# Altium project Boost_shield.PrjPcb
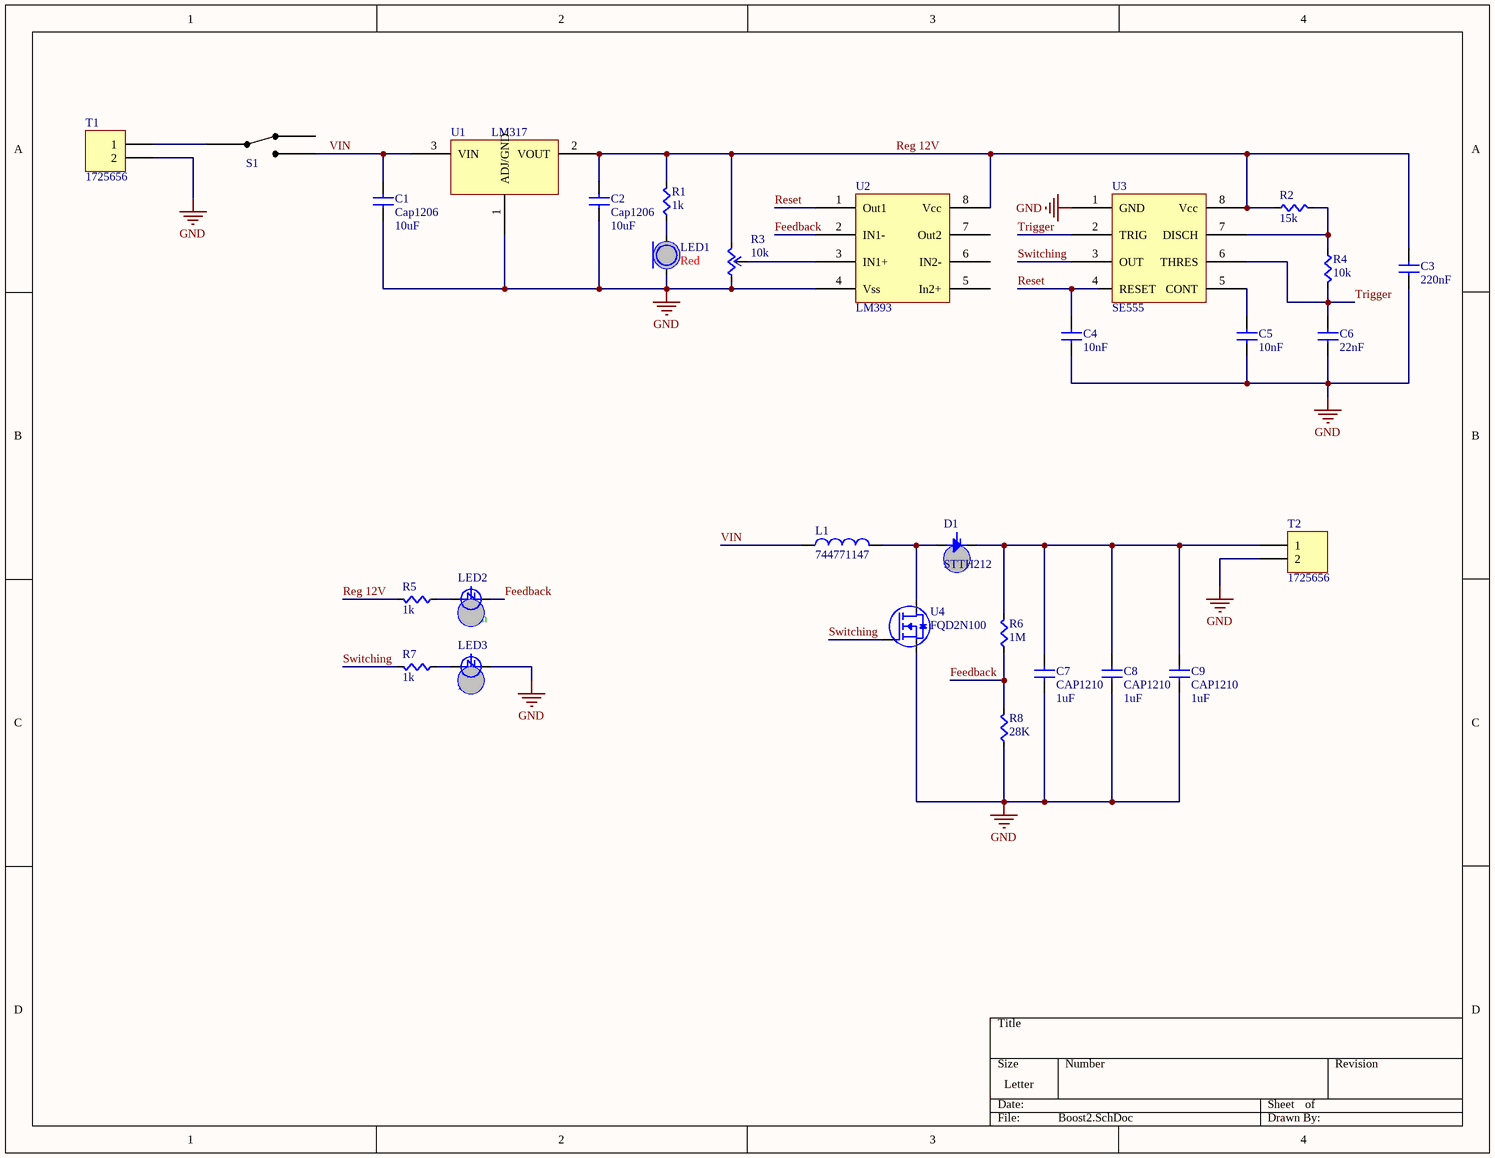
[diagram p0: Boost2.SchDoc]
1 sheet, 29 parts. Net scope: global (net labels, ports and power ports of the same name join across sheets).
Board file: Boost_Shield.PcbDoc

## Sheet Boost2.SchDoc
size Letter

### Parts
C1  Cap1206  value 10uF  [CAP1206]
C2  Cap1206  value 10uF  [CAP1206]
C3  value 220nF  [CAPC0603]  (hidden comment: Cap)
C4  value 10nF  [CAPC0603]  (hidden comment: Cap)
C5  value 10nF  [CAPC0603]  (hidden comment: Cap)
C6  value 22nF  [CAPC0603]  (hidden comment: Cap)
C7  CAP1210  value 1uF  [CAP1210]
C8  CAP1210  value 1uF  [CAP1210]
C9  CAP1210  value 1uF  [CAP1210]
D1  STTH212  [STTH212]
L1  744771147  [744771147]
LED1  Color: Red  [LED0603]  (hidden comment: LED)
LED2  Color: Green  [LED0603]  (hidden comment: LED)
LED3  Color: Blue  [LED0603]  (hidden comment: LED)
R1  value 1k  [RES0603]  (hidden comment: Res)
R2  value 15k  [RES0603]  (hidden comment: Res)
R3  value 10k  [ST4ETA103]  (hidden comment: Pot)
R4  value 10k  [RES0603]  (hidden comment: Res)
R5  value 1k  [RES0603]  (hidden comment: Res)
R6  value 1M  [RES0603]  (hidden comment: Res)
R7  value 1k  [RES0603]  (hidden comment: Res)
R8  value 28K  [RES0805]  (hidden comment: Res)
S1  SPDT Slide Switch  [CL-SB-12B-01T]  (value not drawn)
T1  1725656  [1725656]
T2  1725656  [1725656]
U1  LM317  [LM317]
U2  LM393  [LM393]
U3  SE555  [SE555]
U4  FQD2N100  [FQD2N100]

### Nets
GND: C1.2(B) C2.2(B) C3.2(B) C4.1(A) C5.2(B) C6.2(B) C7.2(B) C8.2(B) C9.2(B) LED1.C LED3.C R3.2 R8.2(B) T1.2 T2.2 U1.1(ADJ/GND) U2.4(Vss) U3.1(GND) U4.S
Feedback: LED2.C R6.2(B) R8.1(A) U2.2(IN1-)
Reg 12V: C2.1(A) C3.1(A) R1.1(A) R2.2(B) R3.1 R5.1(A) U1.2(VOUT) U2.8(Vcc) U3.8(Vcc)
Reset: C4.2(B) U2.1(Out1) U3.4(RESET)
Switching: R7.1(A) U3.3(OUT) U4.G
Trigger: C6.1(A) R4.1(A) U3.2(TRIG) U3.6(THRES)
VIN: C1.1(A) L1.1(A) S1.3 U1.3(VIN)
NetC5_1: C5.1(A) U3.5(CONT)
NetC7_1: C7.1(A) C8.1(A) C9.1(A) D1.C R6.1(A) T2.1
NetD1_A: D1.A L1.2(B) U4.D
NetLED1_A: LED1.A R1.2(B)
NetLED2_A: LED2.A R5.2(B)
NetLED3_A: LED3.A R7.2(B)
NetR2_1: R2.1(A) R4.2(B) U3.7(DISCH)
NetR3_3: R3.3 U2.3(IN1+)
NetS1_2: S1.2 T1.1

Not connected (* = marked no-connect by the designer): S1 1; U2 5(In2+) 6(IN2-) 7(Out2)

### Library data of the parts
C1 C2 = Cap1206: CAP CER 1UF 50V 10% X7R 1206; Supplier 1: Digi-Key; Supplier Part Number 1: 587-2230-1-ND
C7-C9 = CAP1210: CAP CER 10UF 50V 20% X5R 1210; Supplier 1: Digi-Key; Supplier Part Number 1: 587-2225-1-ND
D1 = STTH212: DIODE GEN PURP 1.2KV 2A SMB; Supplier 1: Digi-Key; Supplier Number 1: 497-5762-1-ND
L1 = 744771147: FIXED IND 47UH 2.21A 75 MOHM SMD; Supplier 1: Digi-Key; Supplier Part Number 1: 732-1214-1-ND
R3 = Potentiometer: Supplier 1: Digi-Key; Supplier Part Number 1: ST4ETA103CT-ND
T1 T2 = 1725656: CONN TERM BLOCK 2.54MM 2POS; Supplier 1: Digi-Key; Supplier Part Number 1: 277-1273-ND
U1 = LM317: IC REG LDO ADJ 1.5A SOT223; Supplier 1: Digi-Key; Supplier Part Number 1: 296-12602-1-ND
U2 = LM393: IC VOLT COMPARATOR DUAL 8MISOIC; Supplier 1: Digi-Key; Supplier Part Number 1: 497-7334-1-ND
U3 = SE555: IC OSC SGL TIMER 100KHZ 8SOIC; Supplier 1: Digi-Key; Supplier Part Number 1: 296-41385-1-ND
U4 = FQD2N100: MOSFET N-CH 1000V 1.6A DPAK; Supplier 1: Digi-Key; Supplier Part Number 1: FQD2N100TMCT-ND
C3-C6 = Cap: Supplier 1: Digi-Key; Supplier Part Number 1: 1276-1000-1-ND
LED1-LED3 = LED: Supplier 1: Digi-Key; Supplier Part Number 1: 754-1122-1-ND
R1 R2 R4-R8 = Res: Supplier 1: Digi-Key; Supplier Part Number 1: RMCF0603JT10K0CT-ND
S1 = SPDT Slide Switch: Supplier 1: Digi-Key; Supplier Part Number 1: 563-1318-1-ND